# EasyEDA Pro project CAPSTONE-K'next_Level_Engineering.eprj

# Schematic Schematic1
Board Name: Board1; Create Date: 2026-02-01; Page Name: P1; Project Name: CAPSTONE-K'next_Level_Engineering; Schematic Name: Schematic1; Update Date: 2026-02-01; Company: EasyEDA.com; Page Size: A4; Version: V1.0
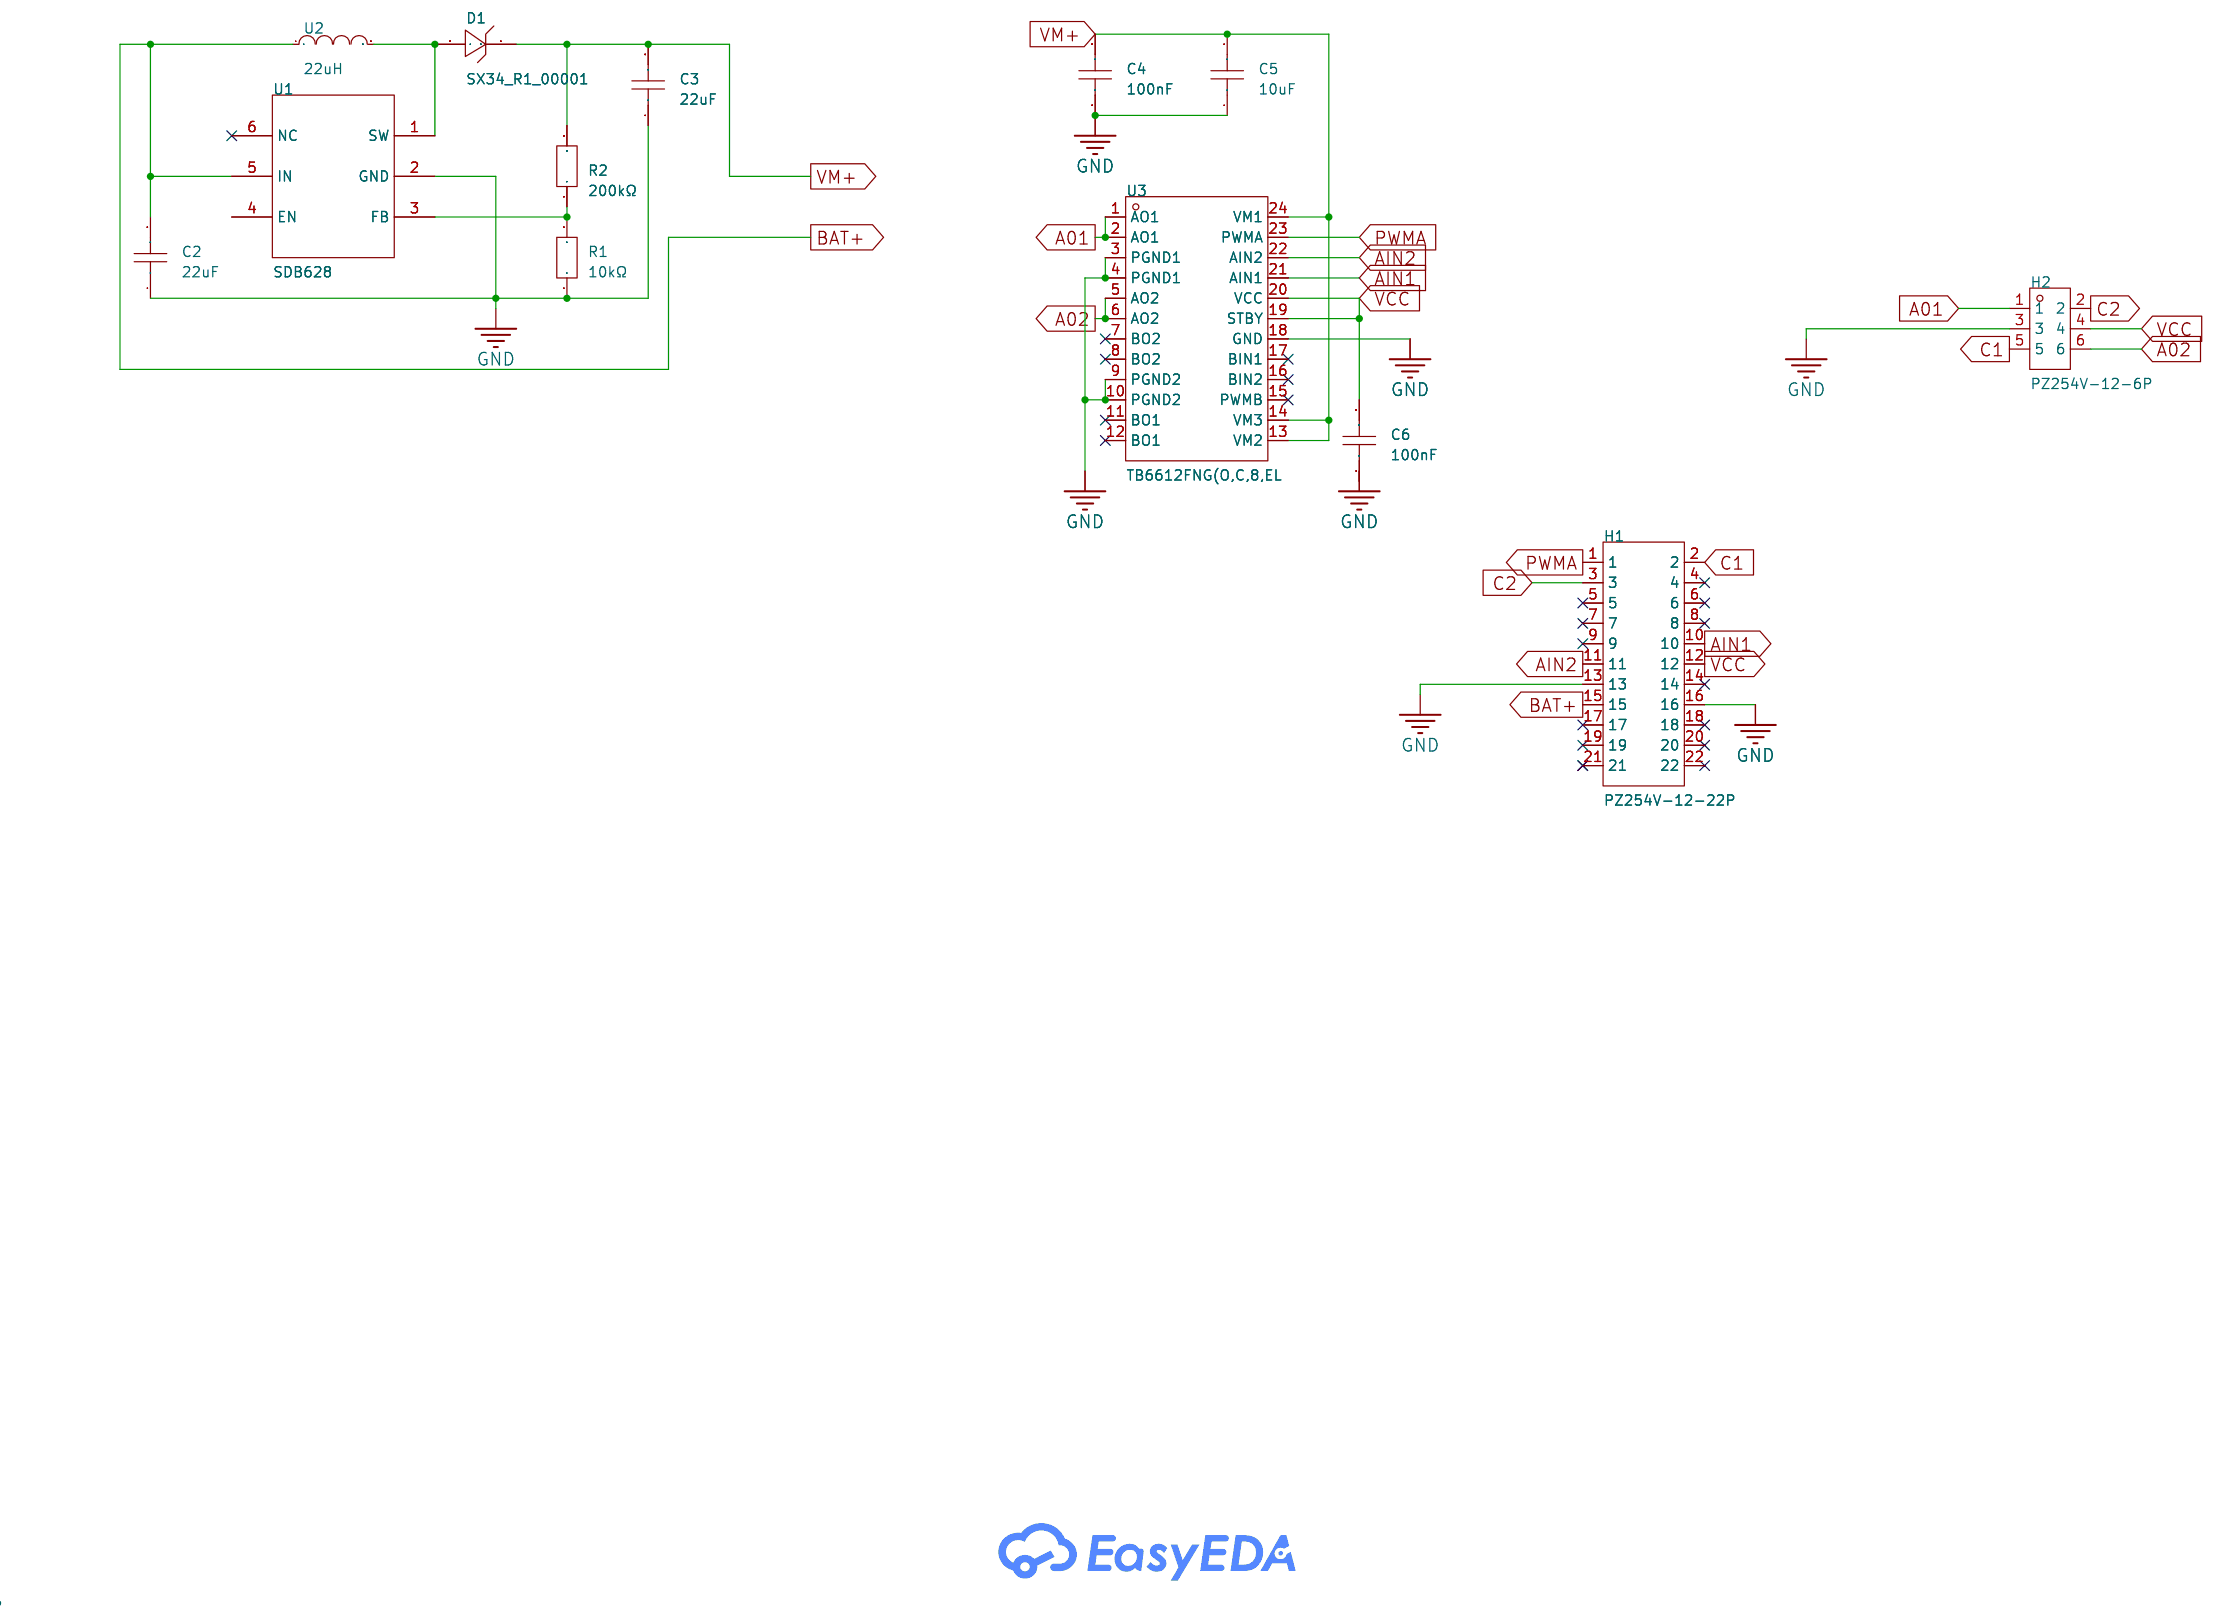
[diagram p0: schematic sheet]

## Parts
C2  22uF  [C0603]
C3  22uF  [C0603]
C4  100nF  [C0402]
C5  10uF  [C0603]
C6  100nF  [C0402]
D1  SX34_R1_00001  [SMA_L4.3-W2.7-LS5.0-RD]
H1  PZ254V-12-22P  [XIAO-nRF52840-SMD]
H2  PZ254V-12-6P  [HDR-TH_6P-P2.54-V-M-R2-C3-S2.54]
R1  10kΩ  [R0603]
R2  200kΩ  [R0603]
U1  SDB628  [SOT-23-6_L2.9-W1.6-P0.95-LS2.8-BL]
U2  22uH  [IND-SMD_L7.2-W6.6_GPSR07X0]
U3  TB6612FNG(O,C,8,EL  [SSOP-24_L8.4-W5.8-P0.65-LS7.8-BL]

## Library data of the parts
C2 C3 = CL10A226MQ8NRNC: LCSC Part Name: 22uF ±20% 6.3V; Supplier Part: C59461; Manufacturer: SAMSUNG(三星); Supplier Footprint: 0603; JLCPCB Part Class: Basic Part; Datasheet: https://item.szlcsc.com/datasheet/CL10A226MQ8NRNC/60514.html; Supplier: LCSC; Tolerance: ±20%; Voltage Rating: 6.3V; Temperature Coefficient: X5R
C4 C6 = CL05B104KO5NNNC: LCSC Part Name: 100nF ±10% 16V; Supplier Part: C1525; Manufacturer: SAMSUNG(三星); Supplier Footprint: 0402; JLCPCB Part Class: Basic Part; Datasheet: https://item.szlcsc.com/datasheet/CL05B104KO5NNNC/1877.html; Supplier: LCSC; Tolerance: ±10%; Voltage Rating: 16V; Temperature Coefficient: X7R
C5 = CL10A106MQ8NNNC: LCSC Part Name: 10uF ±20% 6.3V; Supplier Part: C1691; Manufacturer: SAMSUNG(三星); Supplier Footprint: 0603; JLCPCB Part Class: Extended Part; Datasheet: https://item.szlcsc.com/datasheet/CL10A106MQ8NNNC/2043.html; Supplier: LCSC; Tolerance: ±20%; Voltage Rating: 6.3V; Temperature Coefficient: X5R
D1 = SX34_R1_00001: LCSC Part Name: 电压:40V 电流:3A; Supplier Part: C268717; Manufacturer: PANJIT(强茂); Supplier Footprint: SMA(DO-214AC); JLCPCB Part Class: Extended Part; Datasheet: https://item.szlcsc.com/datasheet/SX34_R1_00001/258128.html; Supplier: LCSC; Voltage - Forward(Vf@If): 500mV@3A; Voltage - DC Reverse(Vr): 40V; Current - Rectified: 3A; Reverse Leakage Current (Ir): 200uA@40V; Operating Junction Temperature Range: -55℃~+125℃; Non-Repetitive Peak Forward Surge Current: 80A
H1 = PZ254V-12-22P: LCSC Part Name: 2x11P 间距:2.54mm 方针 直插; Supplier Part: C492428; Manufacturer: XFCN(兴飞); Supplier Footprint: 插件,P=2.54mm; JLCPCB Part Class: Extended Part; Datasheet: https://item.szlcsc.com/datasheet/PZ254V-12-22P/502984.html; Supplier: LCSC; Pin Structure: 2x11P; Pitch: 2.54mm; Row Spacing: 2.54mm; Circluar Pins/Square Pins: Pin Header; Mounting Type: Through Hole; Number of Rows: 2; Number of Pins: 22P; Length of Mating Pin: 6mm; Insulation Height: 2.5mm; Length of End Connection Pin: 3mm; Contact Material: Brass; Operating Temperature: -40℃~+105℃; Color: Black
H2 = PZ254V-12-6P: LCSC Part Name: 间距:2.54mm 2x3P 直插 方针; Supplier Part: C492420; Manufacturer: XFCN(兴飞); Supplier Footprint: 插件,P=2.54mm; JLCPCB Part Class: Extended Part; Datasheet: https://atta.szlcsc.com/upload/public/pdf/source/20200309/C492420_BAECB307B001054C09D200388220EAE6.pdf; Supplier: LCSC; Pin Structure: 2x3P; Pitch: 2.54mm; Row Spacing: 2.54mm; Circluar Pins/Square Pins: Square Pins; Mounting Type: Straight; Number of Rows: 双排; Number of Pins: 6P; Length of Mating Pin: 6mm; Insulation Height: 2.5mm; Length of End Connection Pin: 3mm; Operating Temperature Range: -40℃~+105℃; Color: Black
R1 = FRC0603J103 TS: LCSC Part Name: 10kΩ ±5% 100mW 厚膜电阻; Supplier Part: C2930027; Manufacturer: FOJAN(富捷); Supplier Footprint: 0603; JLCPCB Part Class: Extended Part; Datasheet: https://item.szlcsc.com/datasheet/FRC0603J103%2520TS/3266960.html; Supplier: LCSC; Type: Thick Film Resistor; Tolerance: ±5%; Power(Watts): 100mW; Voltage-Supply(Max): 75V; Temperature Coefficient: ±100ppm/℃; Operating Temperature: -55℃~+155℃
R2 = FRC0603F2003TS: LCSC Part Name: 200kΩ ±1% 100mW 厚膜电阻; Supplier Part: C2907009; Manufacturer: FOJAN(富捷); Supplier Footprint: 0603; JLCPCB Part Class: Extended Part; Datasheet: https://item.szlcsc.com/datasheet/FRC0603F2003TS/3180522.html; Supplier: LCSC; Type: Thick Film Resistor; Tolerance: ±1%; Power(Watts): 100mW; Voltage-Supply(Max): 75V; Temperature Coefficient: ±100ppm/℃; Operating Temperature: -55℃~+155℃
U1 = SDB628: LCSC Part Name: 高效1.2MHz 2A升压转换器; Supplier Part: C77805; Manufacturer: SHOUDING(首鼎半导体); Supplier Footprint: SOT-23-6; JLCPCB Part Class: Extended Part; Datasheet: https://item.szlcsc.com/datasheet/SDB628/78938.html; Supplier: LCSC; Function: Boost; Voltage - Supply: 2V~24V; Output Voltage: 28V; Output Current: 2A; Frequency - Switching: 1.2MHz; Operating Temperature: -40℃~+85℃; Synchronous Rectifier: No; Number of Outputs: 1; Topology: Boost; Quiescent Current: 1.6mA；100uA; Switch tube (built-in/external): Built-in; Output Type: Adjustable
U2 = CYA0630-22UH: LCSC Part Name: 22uH ±20%; Supplier Part: C5189960; Manufacturer: SHOU HAN(首韩); Supplier Footprint: SMD,7.2x6.6mm; JLCPCB Part Class: Extended Part; Datasheet: https://atta.szlcsc.com/upload/public/pdf/source/20221010/64DDE285D532B36E8D08C8751EC45235.pdf; Supplier: LCSC; Tolerance: ±20%
U3 = TB6612FNG(O,C,8,EL: Supplier Part: C88224; Manufacturer: TOSHIBA(东芝); Supplier Footprint: SSOP-24-208mil; JLCPCB Part Class: Extended Part; Datasheet: https://item.szlcsc.com/datasheet/TB6612FNG(O%252CC%252C8%252CEL/89402.html; Supplier: LCSC; RDS(on): 500mΩ; Peak Current: 3.2A; Operating Temperature: -20℃~+85℃

## Nets
GND: C2.1 C3.1 C4.1 C5.1 C6.1 H1.13 H1.16 H2.3 R1.1 U1.2(GND) U3.3(PGND1) U3.4(PGND1) U3.9(PGND2) U3.10(PGND2) U3.18(GND)
VCC: C6.2 H1.12 H2.4 U3.19(STBY) U3.20(VCC)
A01: H2.1 U3.1(AO1) U3.2(AO1)
A02: H2.6 U3.5(AO2) U3.6(AO2)
AIN1: H1.10 U3.21(AIN1)
AIN2: H1.11 U3.22(AIN2)
BAT+: C2.2 H1.15 U1.5(IN) U2.1
C1: H1.2 H2.5
C2: H1.3 H2.2
PWMA: H1.1 U3.23(PWMA)
VM+: C3.2 C4.2 C5.2 D1.1(C) R2.2 U3.13(VM2) U3.14(VM3) U3.24(VM1)
$1N1048: D1.2(A) U1.1(SW) U2.2
$1N1286: R1.2 R2.1 U1.3(FB)

Not connected (* = marked no-connect by the designer): H1 4* 5* 6* 7* 8* 9* 14* 17* 18* 19* 20* 21* 22*; U1 4(EN) 6(NC)*; U3 7(BO2)* 8(BO2)* 11(BO1)* 12(BO1)* 15(PWMB)* 16(BIN2)* 17(BIN1)*

# Board V0.1
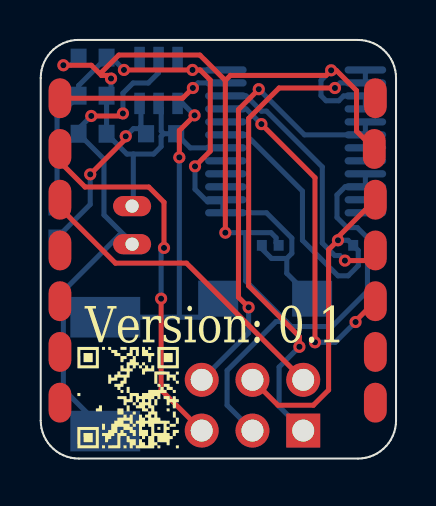
[diagram p1: board, top side]
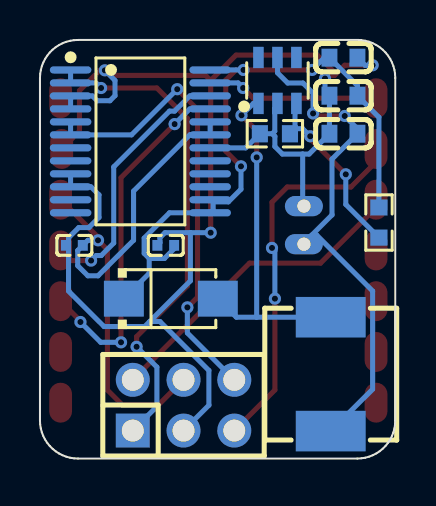
[diagram p2: board, bottom side, seen from below]

Outline 17.78 x 20.96 mm; copper layers: Top Layer, Bottom Layer. Coordinates in mm from the lower left corner of the outline.
Stack: Top Layer 0.035mm / Dielectric1 1.51mm FR4 er 4.5 / Bottom Layer 0.035mm

## Design rules (mm)
template: Custom Config
spacing copperThickness1oz (default): track to track 0.2, other pairs 0.152 to 0.3
spacing copperThickness2oz: track to track 0.203, other pairs 0.152 to 0.3
track width copperThickness1oz (default): min 0.127, default 0.254, max 2.54
track width copperThickness2oz: min 0.203, default 0.254, max 2.54
differential pair differentialPair (default): width min 0.127, default 0.254, max 2.54; gap min 0.152, default 0.152
via viaSize (default): diameter min 0.5, default 0.61, max 10; hole min 0.3, default 0.305, max 6.3

## Placement (name value [footprint] x y rotation side)
C2  22uF  [C0603]  2.59 16.26 180 bottom
C3  22uF  [C0603]  2.59 20.07 0 bottom
C4  100nF  [C0402]  11.48 10.67 180 bottom
C5  10uF  [C0603]  2.59 18.17 180 bottom
C6  100nF  [C0402]  16.06 10.67 180 bottom
D1  SX34_R1_00001  [SMA_L4.3-W2.7-LS5.0-RD]  11.23 8.01 180 bottom
H1  PZ254V-12-22P  [XIAO-nRF52840-SMD]  8.94 10.42 0 top
H2  PZ254V-12-6P  [HDR-TH_6P-P2.54-V-M-R2-C3-S2.54]  10.6 2.67 180 bottom
R1  10kΩ  [R0603]  6.02 16.26 180 bottom
R2  200kΩ  [R0603]  0.82 11.82 90 bottom
U1  SDB628  [SOT-23-6_L2.9-W1.6-P0.95-LS2.8-BL]  5.9 18.93 180 bottom
U2  22uH  [IND-SMD_L7.2-W6.6_GPSR07X0]  3.23 4.23 90 bottom
U3  TB6612FNG(O,C,8,EL  [SSOP-24_L8.4-W5.8-P0.65-LS7.8-BL]  12.75 15.88 270 bottom

## Footprints (pads in the part's own frame, mm; a bottom-side part is the same pattern mirrored in y, then rotated)
C0402
  rect 0.5x0.54 smd: 1(-0.42,0) 2(0.42,0)
C0603
  rect 0.8x0.9 smd: 1(-0.7,0) 2(0.7,0)
HDR-TH_6P-P2.54-V-M-R2-C3-S2.54
  rect 1.7x1.7 hole 1.1: 1(-2.54,-1.27)
  round 1.7 hole 1.1: 2(-2.54,1.27) 3(0,-1.27) 4(0,1.27) 5(2.54,-1.27) 6(2.54,1.27)
IND-SMD_L7.2-W6.6_GPSR07X0
  rect 2.032x3.5 smd: 1(-2.85,0) 2(2.85,0)
R0603
  rect 0.806x0.864 smd: 1(-0.753,0) 2(0.753,0)
SMA_L4.3-W2.7-LS5.0-RD
  rect 2x1.8 smd: 1(-2.35,0) 2(2.35,0)
SOT-23-6_L2.9-W1.6-P0.95-LS2.8-BL
  rect 0.532x1.072 smd: 1(-0.95,-1.149) 2(0,-1.149) 3(0.95,-1.149) 4(0.95,1.149) 5(0,1.149) 6(-0.95,1.149)
SSOP-24_L8.4-W5.8-P0.65-LS7.8-BL
  oval 0.364x2.082 smd: 1(-3.575,-3.491) 2(-2.925,-3.491) 3(-2.275,-3.491) 4(-1.625,-3.491) 5(-0.975,-3.491) 6(-0.325,-3.491) 7(0.325,-3.491) 8(0.975,-3.491) 9(1.625,-3.491) 10(2.275,-3.491) 11(2.925,-3.491) 12(3.575,-3.491) 13(3.575,3.491) 14(2.925,3.491) 15(2.275,3.491) 16(1.625,3.491) 17(0.975,3.491) 18(0.325,3.491) 19(-0.325,3.491) 20(-0.975,3.491) 21(-1.625,3.491) 22(-2.275,3.491) 23(-2.925,3.491) 24(-3.575,3.491)
XIAO-nRF52840-SMD
  rrect 1.143x2 smd: 1(-7.983,7.62) 2(-7.983,5.08) 3(-7.983,2.54) 4(-7.983,0) 5(-7.983,-2.54) 6(-7.983,-5.08) 7(-7.983,-7.62) 8(7.801,-7.62) 9(7.801,-5.08) 10(7.801,-2.54) 11(7.801,0) 12(7.801,2.54) 13(7.747,5.08) 14(7.801,7.62)
  rrect 1.905x1.016 hole 0.66: 15(-4.373,0.314) 16(-4.373,2.219)

## Nets
As in the schematic.

Pads without a net: H1 4 5 6 7 8 9 14; U1 4 6; U3 7 8 11 12 15 16 17

## Via types
v1: diameter 0.61, hole 0.305, Top Layer to Bottom Layer, 25 vias

## Routing (per net, layer and track width the routed paths; a pad name or vN(x,y) marks a point on that pad's centre or on a via; arc(x,y) is an arc through that point)
GND: length 76.9
  Top Layer w0.254: 3.04,19.18 3.04,19.33 3.9,20.2 7.97,20.2 9.24,18.93 ; 3.04,19.18 3.36,19.18 v1(3.52,19.02) ; 3.04,19.18 2.53,19.69 v1(1.13,19.69) ; 9.24,18.93 v1(9.24,11.31) ; 9.24,18.93 9.49,19.18 14.28,19.18 v1(14.53,19.44) 14.79,19.44 15.8,18.42 15.8,16.39 H1.13
  Bottom Layer w0.254: 12.29,6.86 12.54,6.61 14.57,6.61 16.35,8.39 16.35,10.55 ; 12.29,6.86 11.78,6.86 9.33,4.41 9.33,2.67 H2.3 ; 12.29,6.86 10.25,8.89 10.25,11.31 ; 10.25,11.31 v1(9.24,11.31) ; 10.25,11.31 11.52,11.31 11.78,11.05 11.78,10.8 C4.1 ; 16.25,14.25 16.25,13.6 15.23,13.6 14.83,13.2 14.83,12.07 15.33,11.56 15.84,11.56 16.35,11.05 16.35,10.55 ; C3.1 1.51,19.69 v1(1.13,19.69) ; 4.63,15.24 4.63,12.7 H1.16 ; 4.63,15.24 4.31,15.24 C2.1 C5.1 3.52,18.39 v1(3.52,19.02) ; 4.63,15.24 5.65,15.24 6.02,15.62 6.02,16.13 6.16,16.26 ; v1(14.53,19.44) 14.03,18.93 14.03,18.17 14.28,17.91 14.91,17.91 15.16,18.15 16.25,18.15 16.25,17.5 ; 6.16,16.26 R1.1 7.48,15.55 U3.18 ; 6.16,16.26 6.03,16.39 6.03,17.52 5.9,17.65 U1.2 ; 16.35,10.55 C6.1
VCC: length 29
  Top Layer w0.254: H1.12 14.88,11.09 v1(14.88,10.93) 14.41,10.46 14.41,3.43 13.64,2.67 11.87,2.67 H2.4
  Bottom Layer w0.254: U3.20 U3.19 10.28,16.2 13.1,13.39 13.1,10.93 14.88,9.15 15.38,9.15 15.89,9.66 15.89,10.42 C6.2 15.38,10.93 v1(14.88,10.93)
A01: length 24.8
  Top Layer w0.254: v1(12.94,5.6) 12.94,6.1 10.4,8.64 10.4,17.03 11.93,18.55 v1(14.72,18.55)
  Bottom Layer w0.254: v1(14.72,18.55) 14.98,18.8 16.25,18.8 16.25,19.45 ; v1(12.94,5.6) 11.93,4.58 11.93,2.61 H2.1
A02: length 23.1
  Top Layer w0.254: v1(10.4,7.57) 9.9,8.08 9.9,17.47 v1(10.91,18.49)
  Bottom Layer w0.254: v1(10.91,18.49) 13.2,16.2 16.25,16.2 16.25,16.85 ; v1(10.4,7.57) 10.4,6.29 H2.6
AIN1: length 18
  Top Layer w0.254: H1.10 15.76,6.89 v1(15.76,6.84) ; v1(13.72,5.82) 13.72,14.06 v1(11.04,16.74)
  Bottom Layer w0.254: v1(15.76,6.84) 14.74,5.82 v1(13.72,5.82) ; U3.21 10.28,17.5 v1(11.04,16.74)
AIN2: length 13.3
  Top Layer w0.254: H1.11 16.24,9.91 v1(15.22,9.91)
  Bottom Layer w0.254: v1(15.22,9.91) 14.97,10.16 14.71,10.16 14.09,10.79 14.09,14.6 11.3,17.39 11.04,17.39 10.28,18.15 U3.22
BAT+: length 25.5
  Top Layer w0.254: v1(2.53,17.15) 3.99,17.15 v1(4.11,17.28)
  Bottom Layer w0.254: 4.18,11.18 3.93,11.18 1.13,8.39 1.13,3.47 U2.1 ; 4.18,11.18 4.57,10.79 H1.15 ; 4.18,11.18 3.16,12.2 3.16,14.99 C2.2 1.89,16.51 v1(2.53,17.15) ; U1.5 5.89,19.31 5.38,18.8 4.62,18.8 4.11,18.29 v1(4.11,17.28)
C1: length 19
  Top Layer w0.254: v1(6.17,10.55) 6.17,12.83 5.41,13.59 2.22,13.59 1.09,14.72 1.09,15.37 H1.2 ; v1(6.02,8.01) 6.02,3.43 H2.5
  Bottom Layer w0.254: v1(6.17,10.55) 6.02,10.4 v1(6.02,8.01)
C2: length 16.1
  Top Layer w0.254: H1.3 0.96,12.56 3.74,9.78 7.29,9.78 H2.2
PWMA: length 8.6
  Top Layer w0.254: v1(7.61,18.55) 7.1,18.04 H1.1
  Bottom Layer w0.254: v1(7.61,18.55) 7.87,18.8 U3.23
VM+: length 33.2
  Top Layer w0.254: v1(7.72,14.63) 8.48,15.39 8.48,18.95 7.97,19.45 v1(7.59,19.45) v1(4.16,19.45)
  Bottom Layer w0.254: 12.31,10.02 12.31,9.27 D1.1 ; 12.31,10.02 11.55,10.02 11.06,10.5 C4.2 ; 12.31,10.02 12.57,10.27 12.57,11.03 11.3,12.3 U3.13 9.11,12.45 9.11,12.85 ; 9.11,12.85 8.35,12.85 7.72,13.48 v1(7.72,14.63) ; 9.11,12.85 U3.14 ; R2.2 0.82,17.09 C5.2 1.89,18.67 C3.2 3.55,20.07 v1(4.16,19.45) ; v1(7.59,19.45) U3.24
$1N1048: length 17.6
  Top Layer w0.254: v1(6.94,15.08) 6.94,16.42 v1(7.7,17.18)
  Bottom Layer w0.254: U1.1 7.1,17.78 v1(7.7,17.18) ; 6.94,7.08 v1(6.94,15.08) ; 6.94,7.08 7.95,7.08 D1.2 ; 6.94,7.08 U2.2
$1N1286: length 9.1
  Top Layer w0.254: v1(4.25,16.13) 4.25,16.01 v1(2.48,14.23)
  Bottom Layer w0.254: 5.02,16.51 5.02,17.71 U1.3 ; 5.02,16.51 R1.2 ; 5.02,16.51 4.64,16.51 v1(4.25,16.13) ; R2.1 2.48,12.72 v1(2.48,14.23)

## Text on the board
Top Silkscreen Layer: Version: 0.1
